# Altium project Baby_Temp_Monitor.PrjPCB
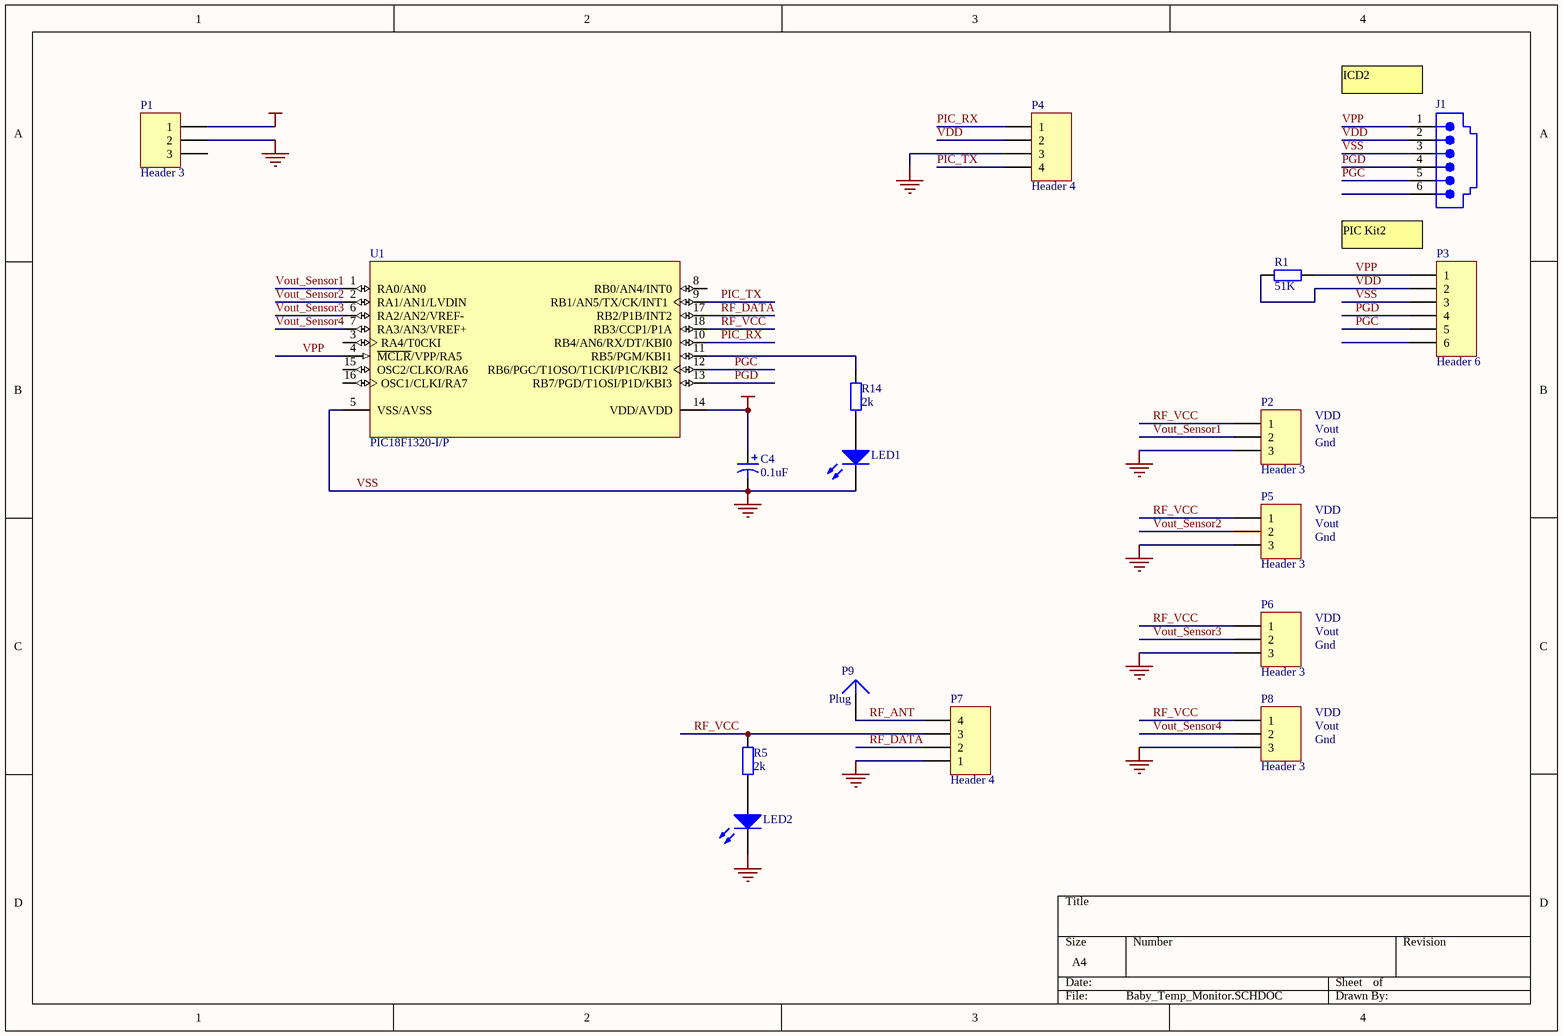
[diagram p0: Baby_Temp_Monitor.SCHDOC]
1 sheet, 17 parts. Net scope: global (net labels, ports and power ports of the same name join across sheets).
Board file: Baby_Temp_Monitor.PcbDoc

## Sheet Baby_Temp_Monitor.SCHDOC
size A4

### Parts
C4  0.1uF  [CAPPR5-5x5]
J1  (no value)  [95009-2667]
LED1  (no value)  [LED-Polarized - 3mm]
LED2  (no value)  [LED-Polarized - 3mm]
P1  Header 3  [HDR1X3]
P2  Header 3  [HDR1X3]
P3  Header 6  [HDR1X6]
P4  Header 4  [HDR1X4]
P5  Header 3  [HDR1X3]
P6  Header 3  [HDR1X3]
P7  Header 4  [HDR1X4]
P8  Header 3  [HDR1X3]
P9  Plug  [PIN1]
R1  51K  [AXIAL-0.3]
R5  2k  [AXIAL-0.4]
R14  2k  [AXIAL-0.3]
U1  PIC18F1320-I/P  [PDIP300-18]

### Nets
VDD: C4.1 J1.2 P1.1 P3.2 P4.2 R1.1 U1.14(VDD/AVDD)
VSS: C4.2 J1.3 LED1.K LED2.K P1.2 P2.3 P3.3 P4.3 P5.3 P6.3 P7.1 P8.3 U1.5(VSS/AVSS)  [also labelled GND]
PGC: J1.5 P3.5 U1.12(RB6/PGC/T1OSO/T1CKI/P1C/KBI2)
PGD: J1.4 P3.4 U1.13(RB7/PGD/T1OSI/P1D/KBI3)
PIC_RX: P4.1 U1.10(RB4/AN6/RX/DT/KBI0)
PIC_TX: P4.4 U1.9(RB1/AN5/TX/CK/INT1)
RF_ANT: P7.4 P9.1
RF_DATA: P7.2 U1.17(RB2/P1B/INT2)
RF_VCC: P2.1 P5.1 P6.1 P7.3 P8.1 R5.2 U1.18(RB3/CCP1/P1A)
Vout_Sensor1: P2.2 U1.1(RA0/AN0)
Vout_Sensor2: P5.2 U1.2(RA1/AN1/LVDIN)
Vout_Sensor3: P6.2 U1.6(RA2/AN2/VREF-)
Vout_Sensor4: P8.2 U1.7(RA3/AN3/VREF+)
VPP: J1.1 P3.1 R1.2 U1.4(~{MCLR}/VPP/RA5)
NetLED1_A: LED1.A R14.1
NetLED2_A: LED2.A R5.1
NetR14_2: R14.2 U1.11(RB5/PGM/KBI1)

Not connected (* = marked no-connect by the designer): J1 6; P1 3; P3 6; U1 3(RA4/T0CKI) 8(RB0/AN4/INT0) 15(OSC2/CLKO/RA6) 16(OSC1/CLKI/RA7)

### Notes on the sheet
- (near J1) ICD2
- PIC Kit2
- VDD
- Vout
- Gnd

### Library data of the parts
C4 = Cap Pol1: Polarized Capacitor (Radial); Published: 8-Jun-2000; LatestRevisionDate: 17-Jul-2002; LatestRevisionNote: Re-released for DXP Platform.; Publisher: Altium Limited
J1 = 95009-2667: Right Angle, Standard Profile, Flush Mount PCB Jack; Ports: 1; Positions/Loaded: Port1 - 6/6; PerformanceCategory: 3; PCB_Mounting: Thru-Hole; DrillSize: Nominal, Rounded to nearest 0.05mm; PCB_Layout: Complies with Manufacturer's Recommendation.; Published: 25-Jun-2002; DatasheetDocument: 18-Dec-2001; PackageDocument: 18-Dec-2001; PackageReference: 95009-2667; Publisher: Altium Limited; ComponentLink1Description: Manufacturer Link; ComponentLink1URL: http://www.molex.com/
LED1 LED2 = LED_3mm: 3mm LED; Published: 8-Jun-2000; LatestRevisionDate: 17-Jul-2002; LatestRevisionNote: Re-released for DXP Platform.; Publisher: Altium Limited
P1 P2 P5 P6 P8 = Header 3: Header, 3-Pin; LatestRevisionDate: 17-Jul-2002; LatestRevisionNote: Re-released for DXP Platform.; Publisher: Altium Limited
P3 = Header 6: Header, 6-Pin; LatestRevisionDate: 17-Jul-2002; LatestRevisionNote: Re-released for DXP Platform.; Publisher: Altium Limited
P4 P7 = Header 4: Header, 4-Pin; LatestRevisionDate: 17-Jul-2002; LatestRevisionNote: Re-released for DXP Platform.; Publisher: Altium Limited
R1 R5 R14 = Res2: Resistor; Published: 8-Jun-2000; LatestRevisionDate: 17-Jul-2002; LatestRevisionNote: Re-released for DXP Platform.; Publisher: Altium Limited
U1 = PIC18F1320-I/P: High Performance, Enhanced FLASH Microcontroller with 10-Bit A/D and nanoWatt Technology, 8K FLASH, 18-Pin PDIP, Standard Volt Range, Industrial Temperature; PackageDocument: DS00049W_2003; Note: RA5 is available only when the M\C\L\R\ Resets are disabled.; Note: OSC1, OSC2, CLKI and CLKO are only available in select Oscillator modes and when these pins are not being used as digital I/O.; Published: 11-Oct-2004; LatestRevisionDate: 4-Mar-2005; LatestRevisionNote: Stylized 3D Model Added.; DatasheetDocument: DS39605B_2002; PackageReference: PDIP300-18; Publisher: Altium Limited; Code_JEDEC: MS-001; ComponentLink1Description: Manufacturer Link; ComponentLink1URL: http://www.microchip.com/index.asp; ComponentLink2Description: Datasheet; ComponentLink2URL: http://ww1.microchip.com/downloads/en/DeviceDoc/39605b.pdf; ComponentLink3Description: Packaging Specification; ComponentLink3URL: http://ww1.microchip.com/downloads/en/PackagingSpec/00049AD.pdf
P9 = Plug: LatestRevisionDate: 17-Jul-2002; LatestRevisionNote: Re-released for DXP Platform.; Publisher: Altium Limited